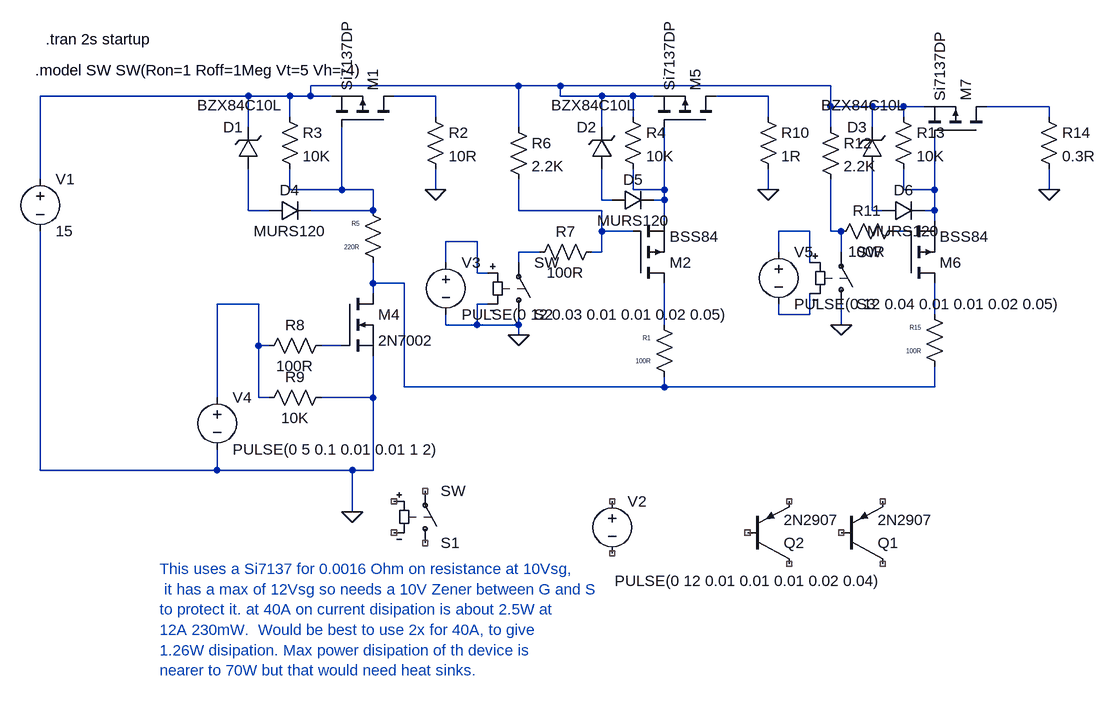
[diagram p0: schematic MosfetSwitchFor12VWithEnable.asc]
MosfetSwitchFor12VWithEnable.asc, the LTspice schematic file:
Version 4
SHEET 1 4224 1060
WIRE 496 192 176 192
WIRE 560 192 496 192
WIRE 976 192 560 192
WIRE 80 208 -240 208
WIRE 144 208 80 208
WIRE 176 208 176 192
WIRE 176 208 144 208
WIRE 208 208 176 208
WIRE 368 208 304 208
WIRE 560 208 560 192
WIRE 624 208 560 208
WIRE 672 208 624 208
WIRE 704 208 672 208
WIRE 880 208 800 208
WIRE 976 224 976 192
WIRE 1040 224 976 224
WIRE 1088 224 1040 224
WIRE 1120 224 1088 224
WIRE 1312 224 1216 224
WIRE 144 240 144 208
WIRE 368 240 368 208
WIRE 672 240 672 208
WIRE 880 240 880 208
WIRE 1088 240 1088 224
WIRE 1312 240 1312 224
WIRE 80 256 80 208
WIRE 496 256 496 192
WIRE 624 256 624 208
WIRE 976 256 976 224
WIRE 1040 256 1040 224
WIRE -240 336 -240 208
WIRE 144 352 144 320
WIRE 224 352 224 256
WIRE 224 352 144 352
WIRE 272 352 224 352
WIRE 368 352 368 320
WIRE 672 352 672 320
WIRE 720 352 720 256
WIRE 720 352 672 352
WIRE 880 352 880 320
WIRE 1088 352 1088 320
WIRE 1136 352 1136 272
WIRE 1136 352 1088 352
WIRE 1312 352 1312 320
WIRE 624 368 624 320
WIRE 640 368 624 368
WIRE 720 368 720 352
WIRE 720 368 704 368
WIRE 80 384 80 320
WIRE 112 384 80 384
WIRE 272 384 272 352
WIRE 272 384 176 384
WIRE 496 384 496 336
WIRE 624 384 496 384
WIRE 1040 384 1040 320
WIRE 1056 384 1040 384
WIRE 1136 384 1136 352
WIRE 1136 384 1120 384
WIRE 720 400 720 368
WIRE 1136 400 1136 384
WIRE 624 416 624 384
WIRE 672 416 624 416
WIRE 944 416 896 416
WIRE 976 416 976 336
WIRE 992 416 976 416
WIRE 1088 416 1072 416
WIRE 432 432 384 432
WIRE 528 448 496 448
WIRE 624 448 624 416
WIRE 624 448 608 448
WIRE 896 448 896 416
WIRE 992 448 992 416
WIRE 384 464 384 432
WIRE 496 464 496 448
WIRE 944 464 944 416
WIRE 432 480 432 432
WIRE 448 480 432 480
WIRE 272 496 272 464
WIRE 320 496 272 496
WIRE 272 512 272 496
WIRE 96 528 32 528
WIRE 448 528 432 528
WIRE 896 544 896 528
WIRE 944 544 944 512
WIRE 944 544 896 544
WIRE 1136 544 1136 496
WIRE 384 560 384 544
WIRE 432 560 432 528
WIRE 432 560 384 560
WIRE 496 560 496 544
WIRE 496 560 432 560
WIRE 720 560 720 496
WIRE 992 560 992 528
WIRE 496 576 496 560
WIRE 96 592 96 528
WIRE 112 592 96 592
WIRE 224 592 192 592
WIRE 320 656 320 496
WIRE 720 656 720 640
WIRE 720 656 320 656
WIRE 1136 656 1136 624
WIRE 1136 656 720 656
WIRE 32 672 32 528
WIRE 96 672 96 592
WIRE 112 672 96 672
WIRE 272 672 272 608
WIRE 272 672 192 672
WIRE -240 784 -240 416
WIRE 32 784 32 752
WIRE 32 784 -240 784
WIRE 240 784 32 784
WIRE 272 784 272 672
WIRE 272 784 240 784
WIRE 240 848 240 784
FLAG 240 848 0
FLAG 496 576 0
FLAG 368 352 0
FLAG 880 352 0
FLAG 992 560 0
FLAG 1312 352 0
SYMBOL sw 352 912 M180
SYMATTR InstName S1
SYMBOL res 736 656 R180
WINDOW 0 36 76 Left 0
WINDOW 3 36 40 Left 0
SYMATTR InstName R1
SYMATTR Value 100R
SYMBOL res 352 224 R0
SYMATTR InstName R2
SYMATTR Value 10R
SYMBOL voltage -240 320 R0
SYMATTR InstName V1
SYMATTR Value 15
SYMBOL voltage 640 816 R0
WINDOW 3 4 138 Left 2
SYMATTR Value PULSE(0 12 0.01 0.01 0.01 0.02 0.04)
SYMATTR InstName V2
SYMBOL res 128 224 R0
SYMATTR InstName R3
SYMATTR Value 10K
SYMBOL pmos 304 256 M270
SYMATTR InstName M1
SYMATTR Value Si7137DP
SYMBOL zener 96 320 R180
WINDOW 0 24 64 Left 2
WINDOW 3 -37 98 Left 2
SYMATTR InstName D1
SYMATTR Value BZX84C10L
SYMBOL sw 496 560 M180
SYMATTR InstName S2
SYMBOL voltage 384 448 R0
SYMATTR InstName V3
SYMATTR Value PULSE(0 12 0.03 0.01 0.01 0.02 0.05)
SYMBOL pnp 992 928 M180
SYMATTR InstName Q1
SYMATTR Value 2N2907
SYMBOL res 288 480 R180
WINDOW 0 36 76 Left 0
WINDOW 3 36 40 Left 0
SYMATTR InstName R5
SYMATTR Value 220R
SYMBOL pmos 672 496 M180
SYMATTR InstName M2
SYMATTR Value BSS84
SYMBOL res 512 464 R270
WINDOW 0 32 56 VTop 2
WINDOW 3 0 56 VBottom 2
SYMATTR InstName R7
SYMATTR Value 100R
SYMBOL nmos 224 512 R0
SYMATTR InstName M4
SYMATTR Value 2N7002
SYMBOL voltage 32 656 R0
SYMATTR InstName V4
SYMATTR Value PULSE(0 5 0.1 0.01 0.01 1 2)
SYMBOL res 208 576 R90
WINDOW 0 0 56 VBottom 2
WINDOW 3 32 56 VTop 2
SYMATTR InstName R8
SYMATTR Value 100R
SYMBOL res 208 656 R90
WINDOW 0 0 56 VBottom 2
WINDOW 3 32 56 VTop 2
SYMATTR InstName R9
SYMATTR Value 10K
SYMBOL pmos 800 256 M270
SYMATTR InstName M5
SYMATTR Value Si7137DP
SYMBOL zener 640 320 R180
WINDOW 0 24 64 Left 2
WINDOW 3 -37 98 Left 2
SYMATTR InstName D2
SYMATTR Value BZX84C10L
SYMBOL res 656 224 R0
SYMATTR InstName R4
SYMATTR Value 10K
SYMBOL pnp 848 928 M180
SYMATTR InstName Q2
SYMATTR Value 2N2907
SYMBOL res 480 240 R0
SYMATTR InstName R6
SYMATTR Value 2.2K
SYMBOL res 864 224 R0
SYMATTR InstName R10
SYMATTR Value 1R
SYMBOL pmos 1088 496 M180
SYMATTR InstName M6
SYMATTR Value BSS84
SYMBOL voltage 896 432 R0
SYMATTR InstName V5
SYMATTR Value PULSE(0 12 0.04 0.01 0.01 0.02 0.05)
SYMBOL sw 992 544 M180
SYMATTR InstName S3
SYMBOL res 976 432 R270
WINDOW 0 32 56 VTop 2
WINDOW 3 0 56 VBottom 2
SYMATTR InstName R11
SYMATTR Value 100R
SYMBOL res 960 240 R0
SYMATTR InstName R12
SYMATTR Value 2.2K
SYMBOL zener 1056 320 R180
WINDOW 0 24 64 Left 2
WINDOW 3 -37 98 Left 2
SYMATTR InstName D3
SYMATTR Value BZX84C10L
SYMBOL res 1072 224 R0
SYMATTR InstName R13
SYMATTR Value 10K
SYMBOL pmos 1216 272 M270
SYMATTR InstName M7
SYMATTR Value Si7137DP
SYMBOL res 1296 224 R0
SYMATTR InstName R14
SYMATTR Value 0.3R
SYMBOL res 1152 640 R180
WINDOW 0 36 76 Left 0
WINDOW 3 36 40 Left 0
SYMATTR InstName R15
SYMATTR Value 100R
SYMBOL diode 112 400 R270
WINDOW 0 32 32 VTop 2
WINDOW 3 0 32 VBottom 2
SYMATTR InstName D4
SYMATTR Value MURS120
SYMATTR Description Zener Diode
SYMATTR Type zener
SYMBOL diode 640 384 R270
WINDOW 0 32 32 VTop 2
WINDOW 3 0 32 VBottom 2
SYMATTR InstName D5
SYMATTR Value MURS120
SYMATTR Description Zener Diode
SYMATTR Type zener
SYMBOL diode 1056 400 R270
WINDOW 0 32 32 VTop 2
WINDOW 3 0 32 VBottom 2
SYMATTR InstName D6
SYMATTR Value MURS120
SYMATTR Description Zener Diode
SYMATTR Type zener
TEXT -248 168 Left 2 !.model SW SW(Ron=1 Roff=1Meg Vt=5 Vh=-4)
TEXT -232 120 Left 2 !.tran 2s startup
TEXT -56 936 Left 2 ;This uses a Si7137 for 0.0016 Ohm on resistance at 10Vsg,\n it has a max of 12Vsg so needs a 10V Zener between G and S \nto protect it. at 40A on current disipation is about 2.5W at \n12A 230mW.  Would be best to use 2x for 40A, to give \n1.26W disipation. Max power disipation of th device is \nnearer to 70W but that would need heat sinks.

The netlist it stands for:
* MosfetSwitchFor12VWithEnable.asc
S1 NC_01 NC_02 NC_03 NC_04 SW
R1 N017 N021 100R
R2 N002 0 10R
V1 N001 0 15
V2 NC_05 NC_06 PULSE(0 12 0.01 0.01 0.01 0.02 0.04)
R3 N001 N005 10K
M1 N002 N005 N001 N001 Si7137DP
D1 N009 N001 BZX84C10L
S2 0 N016 N015 0 SW
V3 N015 0 PULSE(0 12 0.03 0.01 0.01 0.02 0.05)
Q1 NC_07 NC_08 NC_09 0 2N2907
R5 N017 N005 220R
M2 N021 N010 N006 N006 BSS84
R7 N016 N010 100R
M4 N017 N022 0 0 2N7002
V4 N018 0 PULSE(0 5 0.1 0.01 0.01 1 2)
R8 N022 N018 100R
R9 0 N018 10K
M5 N003 N006 N001 N001 Si7137DP
D2 N008 N001 BZX84C10L
R4 N001 N006 10K
Q2 NC_10 NC_11 NC_12 0 2N2907
R6 N001 N010 2.2K
R10 N003 0 1R
M6 N020 N014 N007 N007 BSS84
V5 N012 N019 PULSE(0 12 0.04 0.01 0.01 0.02 0.05)
S3 0 N013 N012 N019 SW
R11 N013 N014 100R
R12 N001 N013 2.2K
D3 N011 N001 BZX84C10L
R13 N001 N007 10K
M7 N004 N007 N001 N001 Si7137DP
R14 N004 0 0.3R
R15 N017 N020 100R
D4 N009 N005 MURS120
D5 N008 N006 MURS120
D6 N011 N007 MURS120
.model D D
.lib standard.dio
.model NPN NPN
.model PNP PNP
.lib standard.bjt
.model NMOS NMOS
.model PMOS PMOS
.lib standard.mos
.model SW SW(Ron=1 Roff=1Meg Vt=5 Vh=-4)
.tran 2s startup
* This uses a Si7137 for 0.0016 Ohm on resistance at 10Vsg,
*  it has a max of 12Vsg so needs a 10V Zener between G and S
* to protect it. at 40A on current disipation is about 2.5W at
* 12A 230mW.  Would be best to use 2x for 40A, to give
* 1.26W disipation. Max power disipation of th device is
* nearer to 70W but that would need heat sinks.
.backanno
.end